# EAGLE design AT42QT1070 Acorn (EAGLE 9.5.2)
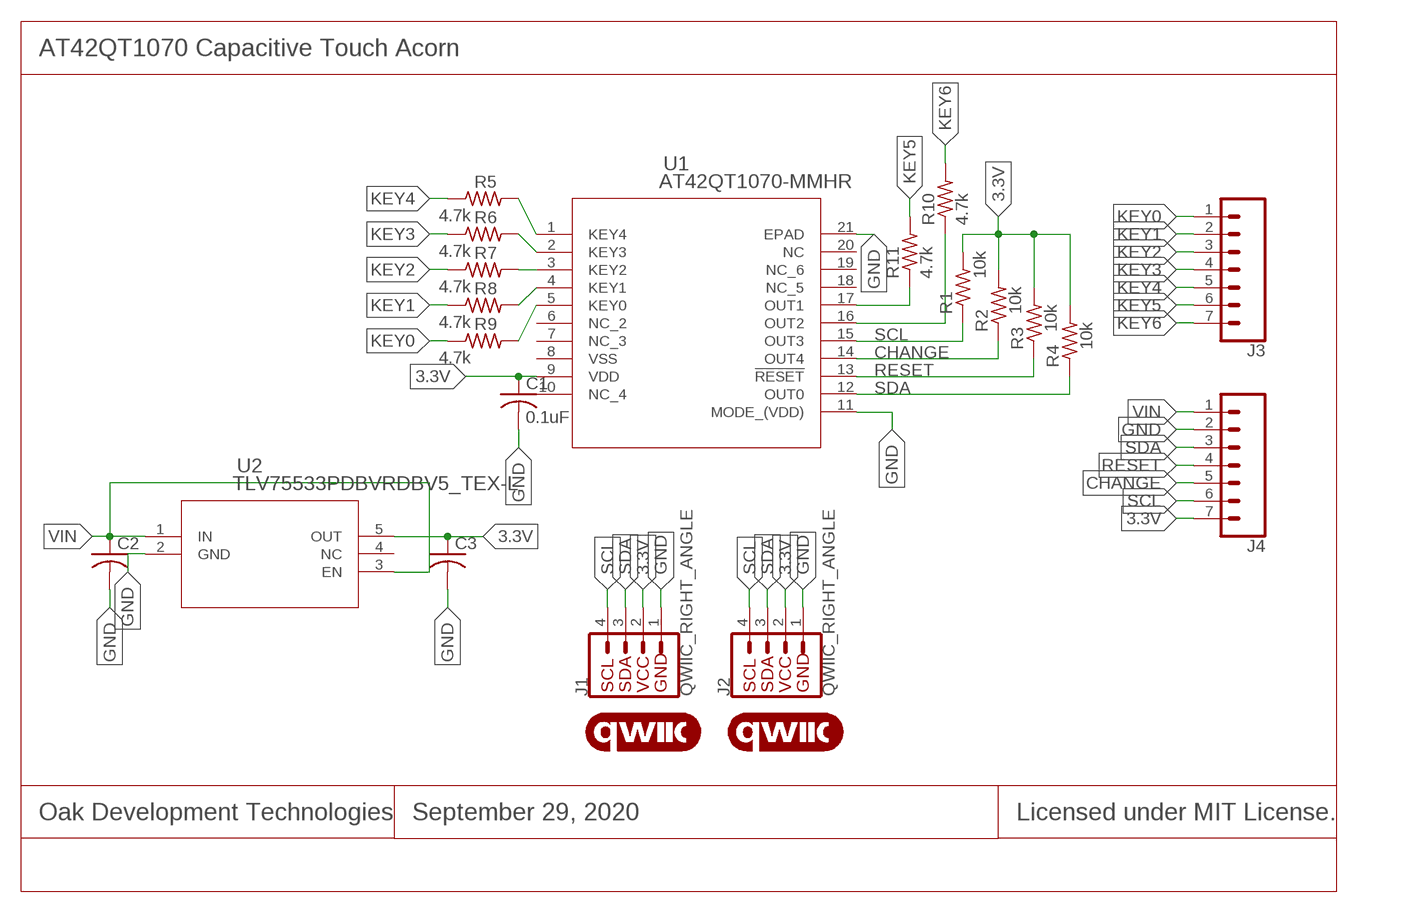
[diagram p0: schematic, sheet 1]

## Parts
C1  0.1uF  C-USC0402  [C0402]
C2  C-USC0402  [C0402]
C3  C-USC0402  [C0402]
J1  QWIIC_RIGHT_ANGLE  QWIIC_CONNECTORJS-1MM  [JST04_1MM_RA]
J2  QWIIC_RIGHT_ANGLE  QWIIC_CONNECTORJS-1MM  [JST04_1MM_RA]
J3  CONN_07NO_SILK  [1X07_NO_SILK]
J4  CONN_07NO_SILK  [1X07_NO_SILK]
LOGO1  QWIIC_LOGO_6MM  [QWIIC_6MM]
LOGO2  QWIIC_LOGO_6MM  [QWIIC_6MM]
R1  10k  R-US_R0402  [R0402]
R2  10k  R-US_R0402  [R0402]
R3  10k  R-US_R0402  [R0402]
R4  10k  R-US_R0402  [R0402]
R5  4.7k  R-US_R0402  [R0402]
R6  4.7k  R-US_R0402  [R0402]
R7  4.7k  R-US_R0402  [R0402]
R8  4.7k  R-US_R0402  [R0402]
R9  4.7k  R-US_R0402  [R0402]
R10  4.7k  R-US_R0402  [R0402]
R11  4.7k  R-US_R0402  [R0402]
U1  AT42QT1070-MMHR  [VQFN20_3X3_MCH]
U2  TLV75533PDBVRDBV5_TEX-L  [DBV5_TEX-L]

## Nets
3.3V: C1.1 C3.1 J1.2 J2.2 J4.7 R1.2 R2.2 R3.2 R4.2 U1.9(VDD) U2.5(OUT)
CHANGE: J4.5 R2.1 U1.14(OUT4)
GND: C1.2 C2.2 C3.2 J1.1 J2.1 J4.2 U1.11(MODE_(VDD)) U1.21(EPAD) U2.2(GND)
KEY0: J3.1 R9.1
KEY1: J3.2 R8.1
KEY2: J3.3 R7.1
KEY3: J3.4 R6.1
KEY4: J3.5 R5.1
KEY5: J3.6 R11.2
KEY6: J3.7 R10.2
N$3: R11.1 U1.17(OUT1)
N$4: R10.1 U1.16(OUT2)
N$5: R5.2 U1.1(KEY4)
N$6: R6.2 U1.2(KEY3)
N$8: R7.2 U1.3(KEY2)
N$9: R8.2 U1.4(KEY1)
N$10: R9.2 U1.5(KEY0)
RESET: J4.4 R3.1 U1.13(!RESET)
SCL: J1.4 J2.4 J4.6 R1.1 U1.15(OUT3)
SDA: J1.3 J2.3 J4.3 R4.1 U1.12(OUT0)
VIN: C2.1 J4.1 U2.1(IN) U2.3(EN)
Unconnected: U1.6(NC_2) U1.7(NC_3) U1.8(VSS) U1.10(NC_4) U1.18(NC_5) U1.19(NC_6) U1.20(NC) U2.4(NC)

## Notes on the sheet
- AT42QT1070 Capacitive Touch Acorn
- Oak Development Technologies | September 29, 2020 | Licensed under MIT License.

## Library data of the parts
C1-C3 = rcl:C-US: CAPACITOR, American symbol; SPICEPREFIX: C
J1 J2 = SparkFun-Connectors:QWIIC_CONNECTOR: SparkFun I2C Standard Qwiic Connector An SMD 1mm pitch JST connector makes it easy and quick (get it? Qwiic?) to connect I2C devices to each other. The Qwiic system <http://www.sparkfun.com/qwiic> enables fast and solderless connection between popular platforms and various sensors and actuators. We carry 200mm <https://www.sparkfun.com/products/14204>, 100mm <https://www.sparkfun.com/products/14205>, 50mm <https://www.sparkfun.com/products/14206>, and breadboard friendly <https://www.sparkfun.com/products/14207> Qwiic cables. We also offer 10 pcs strips <https://www.sparkfun.com/products/14323> the SMD connectors.; PROD_ID: CONN-13694
J3 J4 = SparkFun-Connectors:CONN_07: Multi connection point. Often used as Generic Header-pin footprint for 0.1 inch spaced/style header connections On any of the 0.1 inch spaced packages, you can populate with these: Break Away Headers - Straight <https://www.sparkfun.com/products/116> (PRT-00116) Break Away Male Headers - Right Angle <https://www.sparkfun.com/products/553> (PRT-00553) Female Headers <https://www.sparkfun.com/products/115> (PRT-00115) Break Away Headers - Machine Pin <https://www.sparkfun.com/products/117> (PRT-00117) Break Away Female Headers - Swiss Machine Pin <https://www.sparkfun.com/products/743> (PRT-00743) For SCREWTERMINALS and SPRING TERMINALS visit here: Screw Terimnals on SparkFun.com <https://www.sparkfun.com/search/results?term=Screw+Terminals> (5mm/3.5mm/2.54mm spacing) This device is also useful as a general connection point to wire up your design to another part of your project. Our various solder wires solder well into these plated through hole pads. Hook-Up Wire - Assortment (Stranded, 22 AWG) <https://www.sparkfun.com/products/11375> (PRT-11375) Hook-Up Wire - Assortment (Solid Core, 22 AWG) <https://www.sparkfun.com/products/11367> (PRT-11367) View the entire wire category on our website here <https://www.sparkfun.com/categories/141> Special notes: Molex polarized connector foot print use with SKU : PRT-08231 with associated crimp pins and housings. 1MM SMD Version SKU: PRT-10208 NOTES ON THE VARIANTS LOCK and LOCK_LONGPADS... This footprint was designed to help hold the alignment of a through-hole component (i.e. 6-pin header) while soldering it into place. You may notice that each hole has been shifted either up or down by 0.005 of an inch from it's more standard position (which is a perfectly straight line). This slight alteration caused the pins (the squares in the middle) to touch the edges of the holes. Because they are alternating, it causes a "brace" to hold the component in place. 0.005 has proven to be the perfect amount of "off-center" position when using our standard breakaway headers. Although looks a little odd when you look at the bare footprint, once you have a header in there, the alteration is very hard to notice. Also,if you push a header all the way into place, it is covered up entirely on the bottom side.
LOGO1 LOGO2 = SparkFun-Aesthetics:QWIIC_LOGO: Qwiic Logos for placement on schematic and PCB. The 5.5mm silk logo is best for placing next to Qwiic connector.
R1-R11 = rcl:R-US_: RESISTOR, American symbol; SPICEPREFIX: R
U1 = AT42QT1070-MMHR:AT42QT1070-MMHR; BUILT_BY: EMA_Molly; COPYRIGHT: Copyright (C) 2018 Accelerated Designs. All rights reserved; MANUFACTURER_PART_NUMBER: AT42QT1070-MMHR; SOURCELIBRARY: Microchip_2019-08-23_24; VENDOR: Microchip
U2 = TLV75533pdbvr:TLV75533PDBVR; COPYRIGHT: Copyright (C) 2018 Accelerated Designs. All rights reserved; MANUFACTURER_PART_NUMBER: TLV75533PDBVR; SOURCELIBRARY: TI_2019-06-18; VENDOR: Texas Instruments

## Board
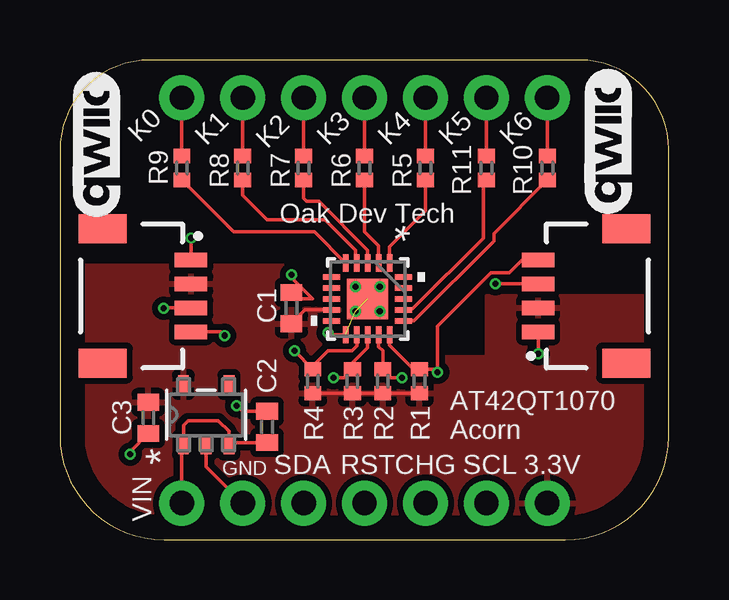
[diagram p1: board, top side]
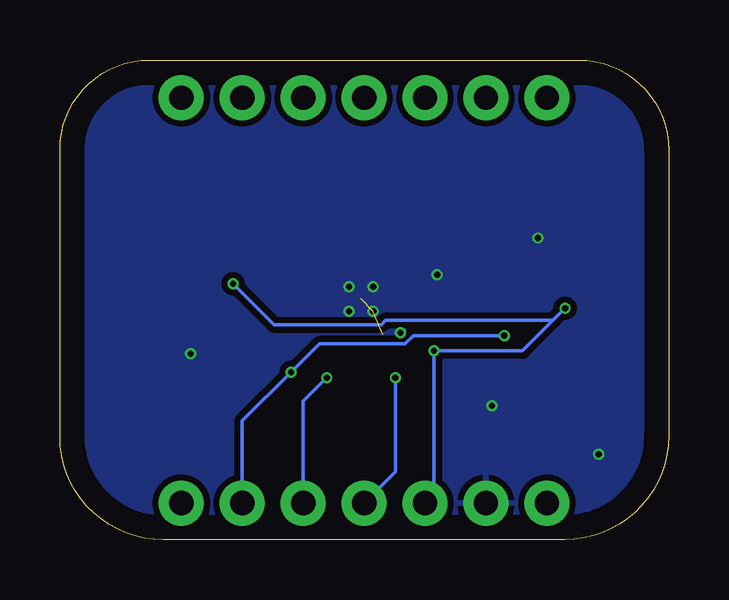
[diagram p2: board, bottom side, seen from below]

Size 25.38 x 19.99 mm. Coordinates in mm from the lower left corner, seen from the top.
Outline: 0,16.23 0,4.34 arc90 4.34,0 21.08,0 arc90 25.38,4.3 25.38,16.27 arc90 21.66,19.99 3.75,19.99 arc90 0,16.23
Copper layers (1*16): Top 0.035mm / dielectric 1.5mm / Bottom 0.035mm
Design rules "default *": minimum track width 6mil, minimum drill 10mil, track to track 6mil, track to pad 6mil, pad to pad 6mil, via to via 6mil, smd to smd 6mil, copper to edge 40mil, drill to drill 6mil, minimum pad ring 10mil, minimum via ring 4mil, stop-mask expansion 4mil, vias tented up to drill 20mil, thermal gap 10mil

### Footprints (pad centres in the part's own frame; a part is rotated, then mirrored left to right if it is on the bottom)
C0402 = smd 0.7 x 0.9: 1 -0.65,0; 2 0.65,0
JST04_1MM_RA = smd 0.6 x 1.35: 1 -1.5,0; 2 -0.5,0; 3 0.5,0; 4 1.5,0 | smd 1.2 x 2: NC1 2.8,-3.675; NC2 -2.8,-3.675
1X07_NO_SILK = drill 1.016 pad 1.88: 1 0,0; 2 2.54,0; 3 5.08,0; 4 7.62,0; 5 10.16,0; 6 12.7,0; 7 15.24,0
R0402 = smd 0.6 x 0.7: 1 -0.5,0; 2 0.5,0
VQFN20_3X3_MCH = smd 0.711 x 0.229: 1 -1.499,0.914; 2 -1.499,0.457; 3 -1.499,0; 4 -1.499,-0.457; 5 -1.499,-0.914; 11 1.499,-0.914; 12 1.499,-0.457; 13 1.499,0; 14 1.499,0.457; 15 1.499,0.914 | smd 0.229 x 0.711: 6 -0.914,-1.499; 7 -0.457,-1.499; 8 0,-1.499; 9 0.457,-1.499; 10 0.914,-1.499; 16 0.914,1.499; 17 0.457,1.499; 18 0,1.499; 19 -0.457,1.499; 20 -0.914,1.499 | smd 1.702 x 1.702: 21 0,0
DBV5_TEX-L = smd 0.775 x 0.457: 1 -1.264,0.95; 2 -1.264,0; 3 -1.264,-0.95; 4 1.264,-0.95; 5 1.264,0.95

### Placement (x,y rotation side)
C1  9.65,9.65 90 top
C2  8.64,4.7 90 top
C3  3.68,5.08 270 top
J1  19.94,10.16 90 top
J2  5.46,10.16 270 top
J3  5.08,18.41 0 top
J4  5.08,1.52 0 top
LOGO1  22.86,16.64 90 top
LOGO2  1.52,16.51 90 top
R1  14.99,6.6 270 top
R2  13.46,6.6 270 top
R3  12.19,6.6 270 top
R4  10.54,6.6 270 top
R5  15.24,15.49 270 top
R6  12.7,15.49 270 top
R7  10.16,15.49 270 top
R8  7.62,15.49 270 top
R9  5.08,15.49 270 top
R10  20.32,15.49 90 top
R11  17.78,15.49 90 top
U1  12.83,10.03 270 top
U2  6.1,5.21 90 top

### Tracks (layer width: path | path; a pad name or v marks a point on that pad's centre or on a via)
3.3V
  Top 0.152: C1.1 10.23,9.58 U1.9 | R4.2 R3.2 R2.2 R1.2
  pour Top (isolate 0.254): -1.27,11.43 10.16,11.43 10.16,10.16 12.7,10.16 12.7,7.62 17.78,7.62 17.78,10.16 26.67,10.16 26.67,-1.27 -1.27,-1.27
CHANGE  (via drill 0.25)
  Top 0.152: U1.14 13.28,8.05 13.46,7.87 R2.1 13.81,6.75 v14.26,6.75
  Bottom 0.152: v14.26,6.75 15.24,5.77 J4.5
GND  (via drill 0.25)  (2 unrouted)
  Top 0.152: J2.1 v5.46,12.57 | J1.1 v19.94,7.75 | C1.2 9.92,10.03 10.54,10.03 9.65,10.92 v9.65,11.05 | U1.11 11.27,8.53 v11.18,8.62 | J4.2 6.1,3.05 U2.2 | C2.2 7.61,5.35 v7.37,5.59 | C3.2 2.92,3.67 v2.92,3.56
  other vias: 12.32,10.54 13.34,10.54 13.34,9.53 12.32,9.53
  pour Bottom (isolate 0.254): -1.27,21.59 26.67,21.59 26.67,-1.27 -1.27,-1.27
KEY0
  Top 0.152: J3.1 R9.1
KEY1
  Top 0.152: J3.2 R8.1
KEY2
  Top 0.152: J3.3 R7.1
KEY3
  Top 0.152: J3.4 R6.1
KEY4
  Top 0.152: J3.5 R5.1
KEY5
  Top 0.152: J3.6 R11.2
KEY6
  Top 0.152: J3.7 R10.2
N$3
  Top 0.152: 17.73,14.94 R11.1 17.65,14.87 17.65,12.57 14.71,9.63 14.38,9.63 U1.17
N$4
  Top 0.152: R10.1 18.09,12.76 18.09,12.45 14.76,9.12 U1.16
N$5
  Top 0.152: U1.1 13.74,12.22 15.24,13.72 R5.2
N$6
  Top 0.152: U1.2 13.28,12.24 12.7,12.83 R6.2
N$8
  Top 0.152: U1.3 12.83,12.06 10.79,14.1 10.29,14.1 10.16,14.22 R7.2
N$9
  Top 0.152: U1.4 12.32,11.58 12.32,12.06 11.05,13.34 8.64,13.34 7.62,14.35 R8.2
N$10
  Top 0.152: U1.5 10.62,12.83 7.25,12.83 R9.2
RESET  (via drill 0.25)
  Top 0.152: U1.13 12.83,8 12.19,7.37 R3.1 11.84,6.75 v11.4,6.75
  Bottom 0.152: v11.4,6.75 11.4,2.83 J4.4
SCL  (via drill 0.25)
  Top 0.152: U1.15 13.74,8.1 14.74,7.1 R1.1 15.63,7.1 v15.75,6.99 15.75,8.9 17.97,11.12 18.75,11.12 19.28,11.66 J1.4 | J2.4 6.71,8.66 v6.86,8.51
  Bottom 0.152: J4.6 17.78,4.95 v15.75,6.99 14.57,8.17 10.99,8.17 10.64,8.51 v6.86,8.51
SDA  (via drill 0.25)
  Top 0.152: 19.63,10.66 J1.3 v18.16,10.67 | U1.12 12.38,8.52 12.38,8.08 12.17,7.87 11.18,7.87 10.54,7.24 R4.1 v9.78,7.87 | J2.3 v4.33,9.66 v4.32,9.65
  Bottom 0.152: J4.3 9.78,1.91 v9.78,7.87 6.1,7.87 v4.32,9.65 4.83,9.14 11.8,9.14 11.98,8.97 16.46,8.97 v18.16,10.67
VIN
  Top 0.152: J4.1 5.08,3.88 U2.1 5.15,4.76 5.33,4.95 6.6,4.95 7.05,4.51 U2.3 7.15,4.05 C2.1

### Text on the board
tNames: K0 | K1 | K2 | K3 | K4 | K5 | K6 | Oak Dev Tech | SDA | RST | AT42QT1070 / Acorn | CHG | SCL | 3.3V | GND | VIN